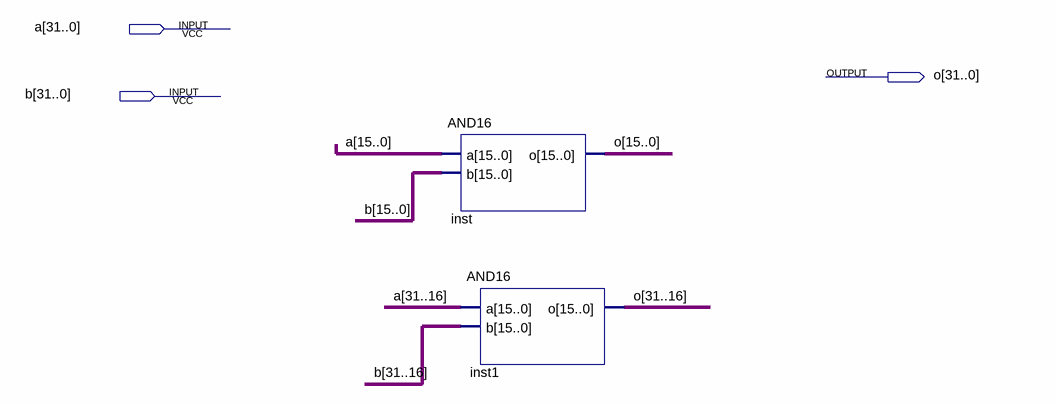
[diagram p0: schematic sheet]
// Quartus schematic AND32.bdf as structural Verilog: 2 symbols, 3 pins
module AND32 (
  input  [31:0] a,
  input  [31:0] b,
  output [31:0] o
);

  AND16 inst (.a(a[15:0]), .b(b[15:0]), .o(o[15:0]));
  AND16 inst1 (.a(a[31:16]), .b(b[31:16]), .o(o[31:16]));
endmodule
